# Altium schematic sheet ADC_connections.SchDoc
size A4
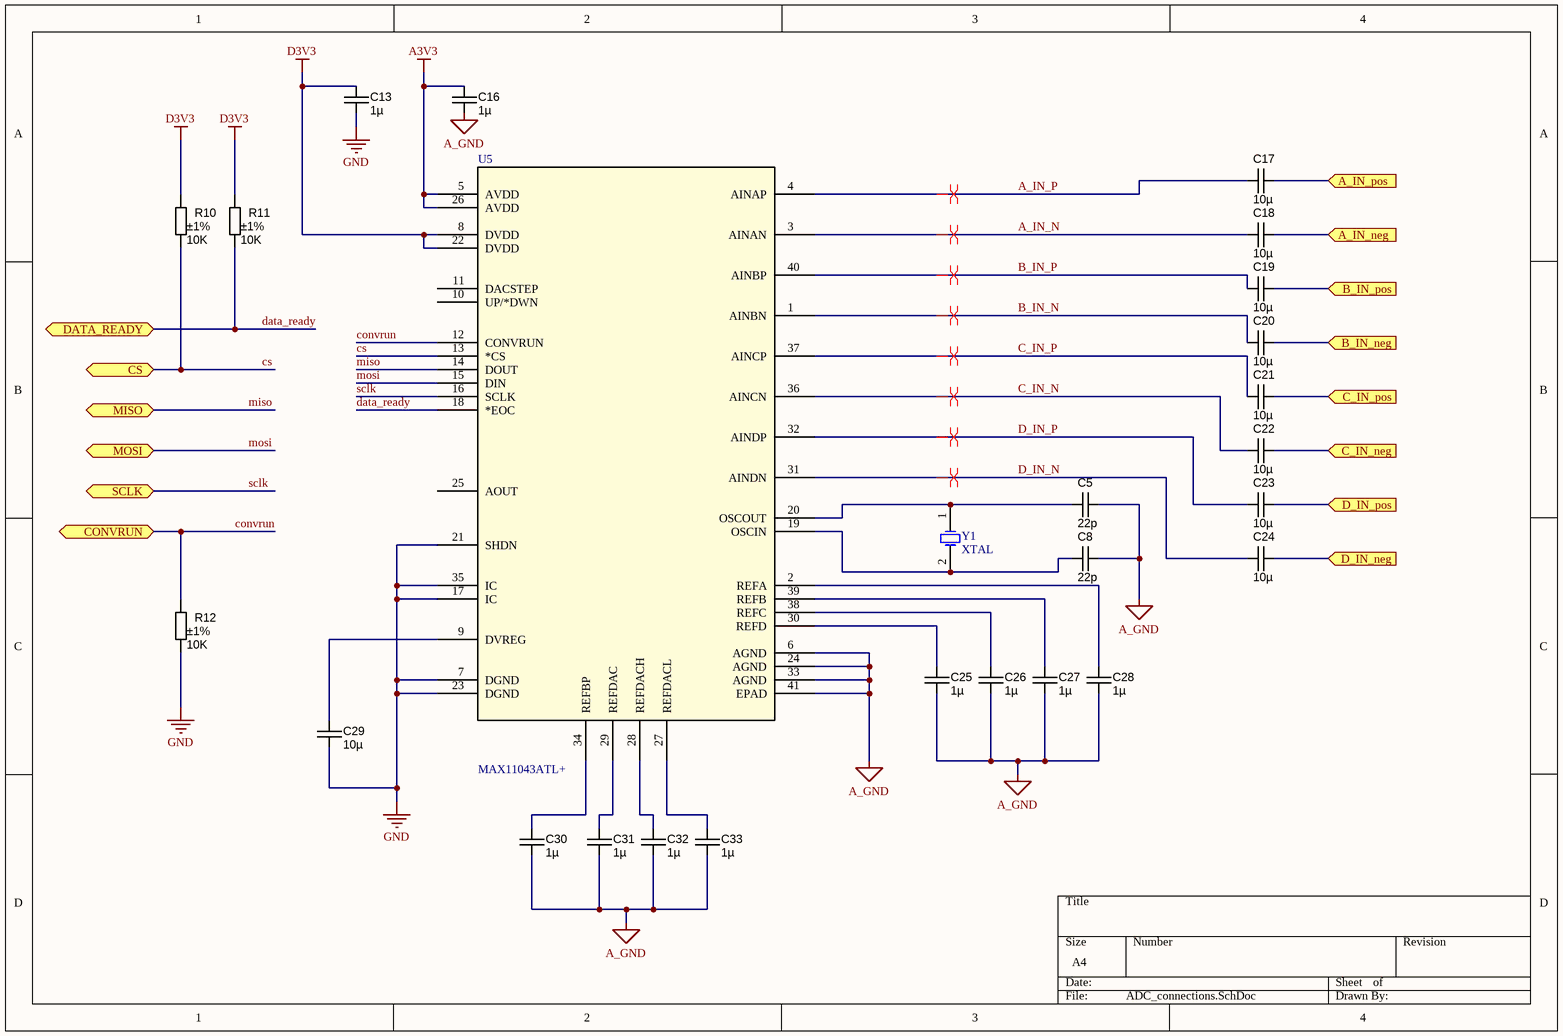
[diagram p0: ADC_connections.SchDoc]

## Parts
C5  value 22p  [CAPC2012X135N]  (hidden comment: approved sub OK)
C8  value 22p  [CAPC2012X135N]  (hidden comment: approved sub OK)
C13  value 1µ  [CAPC2012X135N]  (hidden comment: approved sub OK)
C16  value 1µ  [CAPC2012X135N]  (hidden comment: approved sub OK)
C17  value 10µ  [CAPC2012X135N]  (hidden comment: approved sub OK)
C18  value 10µ  [CAPC2012X135N]  (hidden comment: approved sub OK)
C19  value 10µ  [CAPC2012X135N]  (hidden comment: approved sub OK)
C20  value 10µ  [CAPC2012X135N]  (hidden comment: approved sub OK)
C21  value 10µ  [CAPC2012X135N]  (hidden comment: approved sub OK)
C22  value 10µ  [CAPC2012X135N]  (hidden comment: approved sub OK)
C23  value 10µ  [CAPC2012X135N]  (hidden comment: approved sub OK)
C24  value 10µ  [CAPC2012X135N]  (hidden comment: approved sub OK)
C25  value 1µ  [CAPC2012X135N]  (hidden comment: approved sub OK)
C26  value 1µ  [CAPC2012X135N]  (hidden comment: approved sub OK)
C27  value 1µ  [CAPC2012X135N]  (hidden comment: approved sub OK)
C28  value 1µ  [CAPC2012X135N]  (hidden comment: approved sub OK)
C29  value 10µ  [CAPC2012X135N]  (hidden comment: approved sub OK)
C30  value 1µ  [CAPC2012X135N]  (hidden comment: approved sub OK)
C31  value 1µ  [CAPC2012X135N]  (hidden comment: approved sub OK)
C32  value 1µ  [CAPC2012X135N]  (hidden comment: approved sub OK)
C33  value 1µ  [CAPC2012X135N]  (hidden comment: approved sub OK)
R10  value 10K  Tolerance: ±1%  [RESC2012X70N]  (hidden comment: Thick Film)
R11  value 10K  Tolerance: ±1%  [RESC2012X70N]  (hidden comment: Thick Film)
R12  value 10K  Tolerance: ±1%  [RESC2012X70N]  (hidden comment: Thick Film)
U5  MAX11043ATL+  [21-0141I_T4066-5]
Y1  XTAL  [Quartz Crystal HC-49USSX]

## Ports
A_IN_neg (in), A_IN_pos (in), B_IN_neg (in), B_IN_pos (in), C_IN_neg (in), C_IN_pos (in), CONVRUN, CS, D_IN_neg (in), D_IN_pos (in), DATA_READY, MISO, MOSI, SCLK

## Nets
A3V3: C16.1 U5.5(AVDD) U5.26(AVDD)
A_GND: C5.2 C8.2 C16.2 C25.2 C26.2 C27.2 C28.2 C30.2 C31.2 C32.2 C33.2 U5.6(AGND) U5.24(AGND) U5.33(AGND) U5.41(EPAD)
D3V3: C13.1 R10.1 R11.1 U5.8(DVDD) U5.22(DVDD)
GND: C13.2 C29.1 R12.2 U5.7(DGND) U5.17(IC) U5.21(SHDN) U5.23(DGND) U5.35(IC)
A_IN_N: C18.2 U5.3(AINAN)
A_IN_neg: C18.1 ; port A_IN_neg
A_IN_P: C17.2 U5.4(AINAP)
A_IN_pos: C17.1 ; port A_IN_pos
B_IN_N: C20.2 U5.1(AINBN)
B_IN_neg: C20.1 ; port B_IN_neg
B_IN_P: C19.1 U5.40(AINBP)
B_IN_pos: C19.2 ; port B_IN_pos
C_IN_N: C22.1 U5.36(AINCN)
C_IN_neg: C22.2 ; port C_IN_neg
C_IN_P: C21.1 U5.37(AINCP)
C_IN_pos: C21.2 ; port C_IN_pos
convrun: R12.1 U5.12(CONVRUN) ; port CONVRUN
cs: R10.2 U5.13(*CS) ; port CS
D_IN_N: C24.1 U5.31(AINDN)
D_IN_neg: C24.2 ; port D_IN_neg
D_IN_P: C23.1 U5.32(AINDP)
D_IN_pos: C23.2 ; port D_IN_pos
data_ready: R11.2 U5.18(*EOC) ; port DATA_READY
miso: U5.14(DOUT) ; port MISO
mosi: U5.15(DIN) ; port MOSI
sclk: U5.16(SCLK) ; port SCLK
NetC5_1: C5.1 U5.20(OSCOUT) Y1.1(OSC1)
NetC8_1: C8.1 U5.19(OSCIN) Y1.2(OSC2)
NetC25_1: C25.1 U5.30(REFD)
NetC26_1: C26.1 U5.38(REFC)
NetC27_1: C27.1 U5.39(REFB)
NetC28_1: C28.1 U5.2(REFA)
NetC29_2: C29.2 U5.9(DVREG)
NetC30_1: C30.1 U5.34(REFBP)
NetC31_1: C31.1 U5.29(REFDAC)
NetC32_1: C32.1 U5.28(REFDACH)
NetC33_1: C33.1 U5.27(REFDACL)

Not connected (* = marked no-connect by the designer): U5 10(UP/*DWN) 11(DACSTEP) 25(AOUT)

## Layout directives
differential pair: A_IN_N, A_IN_P, B_IN_N, B_IN_P, C_IN_N, C_IN_P, D_IN_N, D_IN_P

## Library data of the parts
C5 C8 = CAPC_27p_0805_NP0_50V_5%: Capacitor SMD Cer 22pF 5% 50V NP0 0805; Manufacturer 1: Panasonic - ECG; Manufacturer Part Number 1: ECJ-2VC1H270J; Ratings: 50V; NP0; SCDType: undef; Tolerance: ±5%; Operating Temperature: -55°C ~ 125°C; Package / Case: 0805 (2012 metric); Supplier 1: Digi-Key; Supplier Part Number 1: PCC270CGCT-ND
C13 C16 C25-C28 C30-C33 = CAPC_1u_0805_X7R_16V_10%: Capacitor SMD Cer 1uF 10% 16V X7R 0805; Manufacturer 1: Yageo; Manufacturer Part Number 1: CC0805KKX7R7BB105; Ratings: 16V; X7R; Material: ceramic; SCDType: spec; Package / Case: 0805 (2012 metric); Tolerance: ±10%; Supplier 1: Digi-Key; Supplier Part Number 1: 311-1365-6-ND; RoHS 1: RoHS Compliant; Temperature Coefficient: X7R; ComponentLink1URL: http://www.yageo.com/documents/recent/UPY-GPHC_X7R_6.3V-to-50V_8.pdf; ComponentLink1Description: http://www.yageo.com/documents/recent/UPY-GPHC_X7R_6.3V-to-50V_8.pdf; Supplier 2: Digi-Key; Supplier Part Number 2: 399-1284-6-ND; Manufacturer 2: Kemet; Manufacturer Part Number 2: C0805C105K4RACTU; RoHS 2: RoHS Compliant; ComponentLink2URL: http://www.kemet.com/datasheets&C0805C105K4RACTU; ComponentLink2Description: http://www.kemet.com/datasheets&C0805C105K4RACTU; Supplier 3: Digi-Key; Supplier Part Number 3: 1276-1026-6-ND; Manufacturer 3: Samsung Electro-Mechanics America, Inc; Manufacturer Part Number 3: CL21B105KOFNNNE; RoHS 3: RoHS Compliant; ComponentLink3URL: http://www.samsungsem.com/servlet/FileDownload?type=spec&file=CL21B105KOFNNNE.pdf; ComponentLink3Description: http://www.samsungsem.com/servlet/FileDownload?type=spec&file=CL21B105KOFNNNE.pdf; Supplier 4: Digi-Key; Supplier Part Number 4: 445-1358-6-ND; Manufacturer 4: TDK Corporation; Manufacturer Part Number 4: C2012X7R1C105K125AA; RoHS 4: RoHS Compliant; ComponentLink4URL: http://product.tdk.com/capacitor/mlcc/en/documents/mlcc_commercial_general_en.pdf; ComponentLink4Description: http://product.tdk.com/capacitor/mlcc/en/documents/mlcc_commercial_general_en.pdf
C17-C24 C29 = CAPC_10u_0805_10V: Capacitor SMD Cer 10uF 10% 10V X5R 0805; Manufacturer 1: AVX Corporation; Manufacturer Part Number 1: 0805ZD106KAT2A; Ratings: 10V; X5R; Material: ceramic; SCDType: spec; Package / Case: 0805 (2012 metric); Tolerance: ±10%; Manufacturer 2: Kemet; Manufacturer Part Number 2: C0805C106K8PACTU; Supplier 1: Digi-Key; Supplier Part Number 1: 478-5167-1-ND; ComponentLink1URL: http://www.avx.com/docs/Catalogs/cx5r.pdf; ComponentLink1Description: http://www.avx.com/docs/Catalogs/cx5r.pdf; ComponentLink2URL: http://www.kemet.com/datasheets&C0805C106K8PACTU; ComponentLink2Description: http://www.kemet.com/datasheets&C0805C106K8PACTU; Supplier 2: Digi-Key; Supplier Part Number 2: 399-4925-1-ND
R10-R12 = RES_10K_0805_1%: Resistor SMD chip 10k Ohm 0.125W 1% 0805; Manufacturer 1: Vishay/Dale; Manufacturer Part Number 1: CRCW080510K0FKEA; Ratings: 1/8W; SCDType: spec; Package / Case: 0805 (2012 metric); Supplier 1: Digi-Key; Supplier Part Number 1: 541-10.0KCCT-ND; Material: Thick Film
U5 = MAX11043ATL+: Imported; Vendor: Maxim Integrated Products; Built_By: EMA_UL_Team; C: Copyright (C) 2015 Accelerated Designs. All rights reserved; Manufacturer_Part_Number: MAX11043ATL+; RefDes: RefDes; Type: DEV; Value: Value
Y1 = XTAL: Crystal Oscillator; Published: 8-Jun-2000; LatestRevisionDate: 17-Jul-2002; LatestRevisionNote: Re-released for DXP Platform.; PackageReference: R38; Publisher: Altium Limited; PackageDescription: Crystal, Thru-Hole; 2 Leads; Body 3.1 x 8.2 mm (Dia.xH)